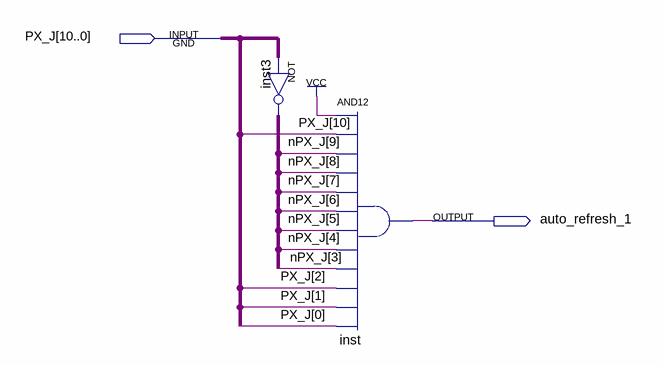
[diagram p0: schematic sheet]
// Quartus schematic dram_auto_refresh_1.bdf as structural Verilog: 2 symbols, 2 pins
module dram_auto_refresh_1 (
  input  [10:0] PX_J,
  output auto_refresh_1
);

  wire [10:0] nPX_J;

  assign nPX_J = ~PX_J;  // NOT inst3, 11 bits wide
  and inst (auto_refresh_1, 1'b1, PX_J[10], nPX_J[9], nPX_J[8], nPX_J[7], nPX_J[6], nPX_J[5], nPX_J[4], nPX_J[3], PX_J[2], PX_J[1], PX_J[0]);
endmodule
